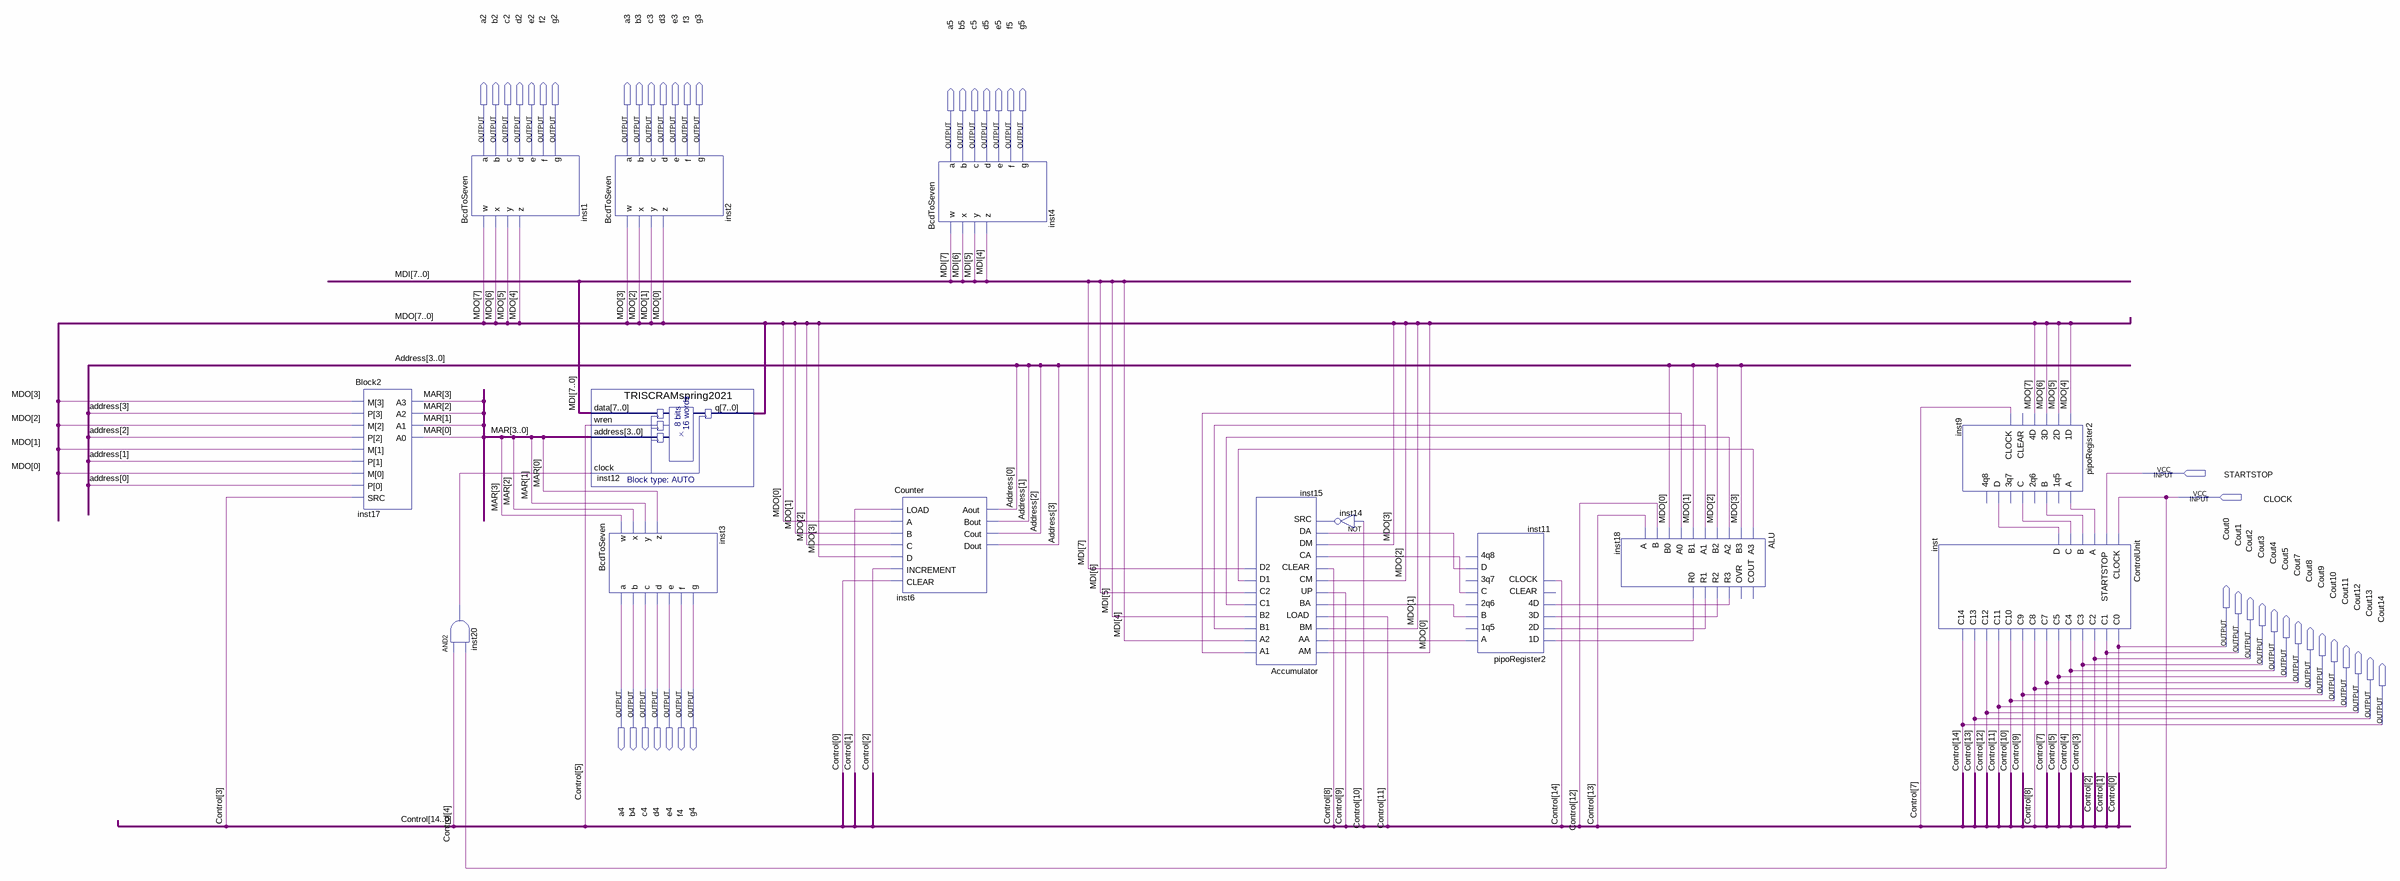
[diagram p0: schematic sheet]
// Quartus schematic TRISC.bdf as structural Verilog: 14 symbols, 44 pins
module TRISC (
  input  STARTSTOP,
  input  CLOCK,
  output a2,
  output b2,
  output c2,
  output d2,
  output e2,
  output f2,
  output g2,
  output a3,
  output b3,
  output c3,
  output d3,
  output e3,
  output f3,
  output g3,
  output a5,
  output b5,
  output c5,
  output d5,
  output e5,
  output f5,
  output g5,
  output Cout0,
  output Cout1,
  output Cout2,
  output Cout3,
  output Cout4,
  output Cout5,
  output Cout7,
  output a4,
  output b4,
  output c4,
  output d4,
  output e4,
  output f4,
  output g4,
  output Cout8,
  output Cout9,
  output Cout10,
  output Cout11,
  output Cout12,
  output Cout13,
  output Cout14
);

  wire inst9_a, inst9_b, inst9_c, inst9_d, inst11_a, inst11_b, inst11_c, inst11_d, inst14_out, inst15_a1,
       inst15_b1, inst15_c1, inst15_d1, inst18_r0, inst18_r1, inst18_r2, inst18_r3, inst20_out;
  wire [3:0] Address, MAR;
  wire [7:0] MDI, MDO;

  Block2 inst17 (.M(MDO[3:0]), .P(Address), .SRC(Cout3), .A3(MAR[3]), .A2(MAR[2]), .A1(MAR[1]), .A0(MAR[0]));
  BcdToSeven inst1 (
    .w(MDO[7]), .x(MDO[6]), .y(MDO[5]), .z(MDO[4]), .a(a2), .b(b2), .c(c2), .d(d2), .e(e2), .f(f2), .g(g2));
  and inst20 (inst20_out, Cout4, CLOCK);
  BcdToSeven inst2 (
    .w(MDO[3]), .x(MDO[2]), .y(MDO[1]), .z(MDO[0]), .a(a3), .b(b3), .c(c3), .d(d3), .e(e3), .f(f3), .g(g3));
  TRISCRAMspring2021 inst12 (.data(MDI), .wren(Cout5), .address(MAR), .clock(inst20_out), .q(MDO));
  BcdToSeven inst3 (
    .w(MAR[3]), .x(MAR[2]), .y(MAR[1]), .z(MAR[0]), .a(a4), .b(b4), .c(c4), .d(d4), .e(e4), .f(f4), .g(g4));
  Counter inst6 (
    .LOAD(Cout1), .A(MDO[0]), .B(MDO[1]), .C(MDO[2]), .D(MDO[3]), .INCREMENT(Cout2), .CLEAR(Cout0),
    .Aout(Address[0]), .Bout(Address[1]), .Cout(Address[2]), .Dout(Address[3]));
  BcdToSeven inst4 (
    .w(MDI[7]), .x(MDI[6]), .y(MDI[5]), .z(MDI[4]), .a(a5), .b(b5), .c(c5), .d(d5), .e(e5), .f(f5), .g(g5));
  Accumulator inst15 (
    .AM(MDO[0]), .AA(inst11_a), .BM(MDO[1]), .LOAD(Cout11), .BA(inst11_b), .UP(Cout9), .CM(MDO[2]),
    .CLEAR(Cout8), .CA(inst11_c), .DM(MDO[3]), .DA(inst11_d), .SRC(inst14_out), .A1(inst15_a1), .A2(MDI[4]),
    .B1(inst15_b1), .B2(MDI[5]), .C1(inst15_c1), .C2(MDI[6]), .D1(inst15_d1), .D2(MDI[7]));
  not inst14 (inst14_out, Cout10);
  pipoRegister2 inst11 (
    .\1D (inst18_r0), .\2D (inst18_r1), .\3D (inst18_r2), .\4D (inst18_r3), .CLOCK(Cout14), .A(inst11_a),
    .B(inst11_b), .C(inst11_c), .D(inst11_d));  // open: CLEAR, 1q5, 2q6, 3q7, 4q8
  ALU inst18 (
    .A3(inst15_d1), .B3(MDO[3]), .A2(inst15_c1), .B2(MDO[2]), .A1(inst15_b1), .B1(MDO[1]), .A0(inst15_a1),
    .B0(MDO[0]), .B(Cout12), .A(Cout13), .R3(inst18_r3), .R2(inst18_r2), .R1(inst18_r1), .R0(inst18_r0));  // open: COUT, OVR
  ControlUnit inst (
    .CLOCK(CLOCK), .STARTSTOP(STARTSTOP), .A(inst9_a), .B(inst9_b), .C(inst9_c), .D(inst9_d), .C0(Cout0),
    .C1(Cout1), .C2(Cout2), .C3(Cout3), .C4(Cout4), .C5(Cout5), .C7(Cout7), .C8(Cout8), .C9(Cout9),
    .C10(Cout10), .C11(Cout11), .C12(Cout12), .C13(Cout13), .C14(Cout14));
  pipoRegister2 inst9 (
    .\1D (MDO[4]), .\2D (MDO[5]), .\3D (MDO[6]), .\4D (MDO[7]), .CLOCK(Cout7), .A(inst9_a), .B(inst9_b),
    .C(inst9_c), .D(inst9_d));  // open: CLEAR, 1q5, 2q6, 3q7, 4q8

  // Other names for the same wires on the sheet: Control (some bits) = {Cout14, Cout13, Cout12, Cout11, Cout10, Cout9, Cout8, Cout7, Cout5, Cout4, Cout3, Cout2, Cout1, Cout0}
endmodule
